# Altium project IFE_AccelPedal_2019.PrjPcb
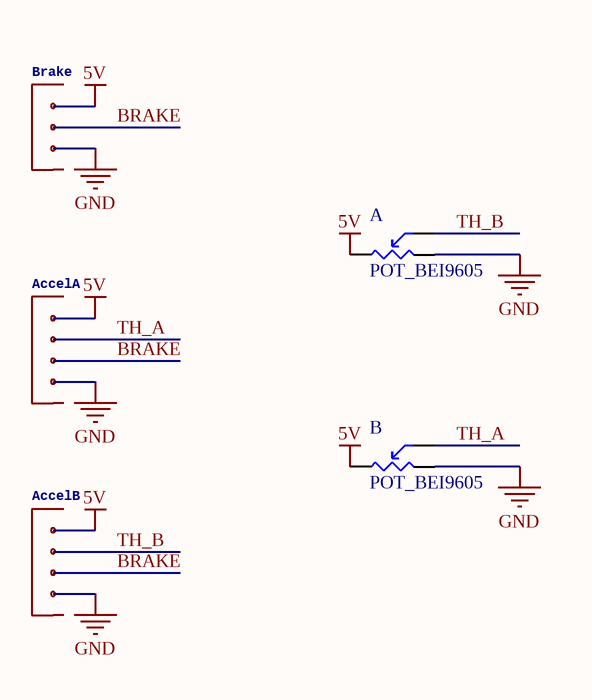
[diagram p0: ife19_Elec_TS_accelpedal.SchDoc]
1 sheet, 5 parts. Net scope: global (net labels, ports and power ports of the same name join across sheets).
Board file: ife19_Elec_TS_accelpedal.PcbDoc

## Sheet ife19_Elec_TS_accelpedal.SchDoc
size A

### Parts
A  POT_BEI9605  [POT_BEI9605]
AccelA  Molex 505575-04 4 Position 2.00mm pitch connector wire to board connector Datasheet  [505578-04]  (value not drawn)
AccelB  Molex 505575-04 4 Position 2.00mm pitch connector wire to board connector Datasheet  [505578-04]  (value not drawn)
B  POT_BEI9605  [POT_BEI9605]
Brake  Molex 505575-03 3 Position 2.00mm pitch connector wire to board connector Datasheet  [505578-03]  (value not drawn)

### Nets
5V: A.3 AccelA.1 AccelB.1 B.3 Brake.1
GND: A.1 AccelA.4 AccelB.4 B.1 Brake.3
BRAKE: AccelA.3 AccelB.3 Brake.2
TH_A: AccelA.2 B.2
TH_B: A.2 AccelB.2

### Library data of the parts
AccelA AccelB = POS4_ML505578-04: GateName_1: G$1; SymbolName_1: 4POS; LibraryName: MOLEX Micro-Lock; DeviceSetName: 505575-04; Package: 505575-04
Brake = POS3_ML505578-03: GateName_1: G$1; SymbolName_1: 3POS; LibraryName: MOLEX Micro-Lock; DeviceSetName: 505575-03; Package: 505575-03